# Altium schematic sheet Monostable_generator_PIC10(L)F322.SchDoc
size A4
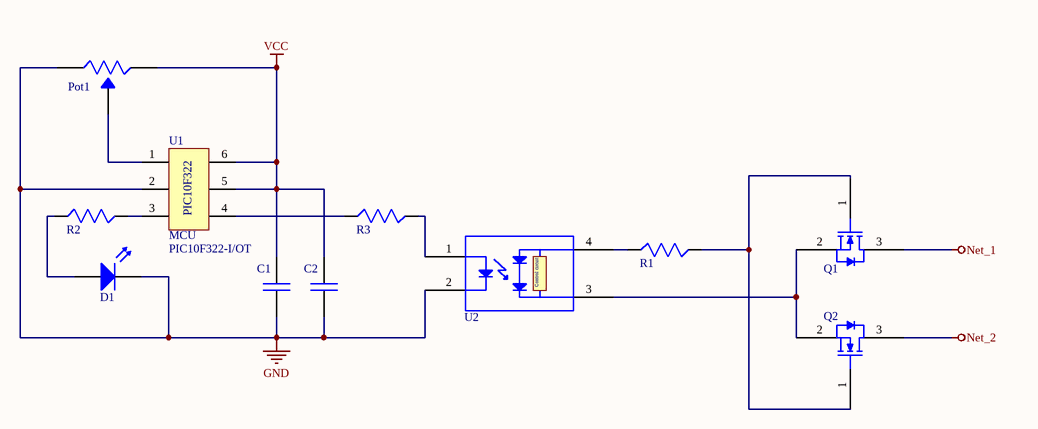
[diagram p0: Monostable_generator_PIC10(L)F322.SchDoc]

## Parts
C1  C0805C104M3RACTU  [Capacitor]  (value not drawn)
C2  C0805C104M3RACTU  [Capacitor]  (value not drawn)
D1  LED  [Diode]  (value not drawn)
Pot1  3305SMD  [CA6XVSMD]  (value not drawn)
Q1  BSS205NH6327  [SOT95P250X110-3N]  (value not drawn)
Q2  BSS205NH6327  [SOT95P250X110-3N]  (value not drawn)
R1  SWR1206-24R-5%  [Resistor]  (value not drawn)
R2  SWR1206-24R-5%  [Resistor]  (value not drawn)
R3  SWR1206-24R-5%  [Resistor]  (value not drawn)
U1  MCU  [SOT95P270X145-6N]
U2  APV2121S  [SOP254P680X210-4N]  (value not drawn)

## Nets
GND: C1.1 C2.1 D1.K Pot1.1 U1.2 U2.2
Net_1: Q1.3
Net_2: Q2.3
VCC: C1.2 C2.2 Pot1.3 U1.5 U1.6
NetD1_A: D1.A R2.1
NetPot1_2: Pot1.2 U1.1
NetQ1_1: Q1.1 Q2.1 R1.1
NetQ1_2: Q1.2 Q2.2 U2.3
NetR1_2: R1.2 U2.4
NetR2_2: R2.2 U1.3
NetR3_1: R3.1 U1.4
NetR3_2: R3.2 U2.1

## Notes on the sheet
- (in symbol APV2121S) Control circuit
- (in symbol PIC10F322-I/OT) PIC10F322

## Library data of the parts
C1 C2 = C0805C104M3RACTU: CAP CER 0.1UF 25V X7R 0805; Manufacturer: KEMET; Dielectric Material: Ceramic; Tolerance: 20%; Dissipation Factor: 5%; *: 100nF; Capacity_number: C?; Supplier 1: Digi-Key; Supplier Part Number 1: 399-8000-1-ND; RoHS: Yes; Stock 1: 353956; Pricing 1: 1=0,10000, 10=0,06500, 50=0,03520, 100=0,02870, 500=0,02052, 1000=0,01613 (USD); Mount: Surface Mount; Case/Package: 0805; Case Code (Metric): 2012; Case Code (Imperial): 0805; Min Operating Temperature: -55°C; Max Operating Temperature: 125°C; Package Quantity: 1; Voltage Rating: 25V; Packaging: Tape and Reel; Voltage Rating (DC): 25V; Dielectric: X7R; Termination: SMD/SMT; Voltage: 25V; Length: 2mm; Width: 0.049inch; Height: 0.9mm; Thickness: 0.035inch; Lead Pitch: 0.75mm; Depth: 1.25mm; Radiation Hardening: No; REACH SVHC: No SVHC; ComponentLink1URL: http://components.arrow.com/part/dataview/2091097S3491315N7429?src-supplier=Arrow+Electronics; ComponentLink1Description: http://components.arrow.com/part/dataview/2091097S3491315N7429?src-supplier=Arrow+Electronics; ComponentLink2URL: http://uk.rs-online.com/webdocs/13da/0900766b813da9ff.pdf?src-supplier=RSComponents; ComponentLink2Description: http://uk.rs-online.com/webdocs/13da/0900766b813da9ff.pdf?src-supplier=RSComponents; ComponentLink3URL: http://components.arrow.com/part/dataview/0323_00178100?src-supplier=Arrow+Europe; ComponentLink3Description: http://components.arrow.com/part/dataview/0323_00178100?src-supplier=Arrow+Europe; ComponentLink4URL: http://uk.rs-online.com/webdocs/13da/0900766b813daa05.pdf?src-supplier=RSComponents; ComponentLink4Description: http://uk.rs-online.com/webdocs/13da/0900766b813daa05.pdf?src-supplier=RSComponents; ComponentLink5URL: https://www.alliedelec.com/m/d/6f3b5eb83d09db50ed28bdc730567b33.pdf?src-supplier=Allied+Electronics; ComponentLink5Description: https://www.alliedelec.com/m/d/6f3b5eb83d09db50ed28bdc730567b33.pdf?src-supplier=Allied+Electronics; ComponentLink6URL: http://www.farnell.com/datasheets/2746330.pdf?src-supplier=Farnell; ComponentLink6Description: http://www.farnell.com/datasheets/2746330.pdf?src-supplier=Farnell; ComponentLink7URL: https://www.alliedelec.com/m/d/e7aa2b5497e2375e4ffc0e8be19e16e2.pdf?src-supplier=Allied+Electronics; ComponentLink7Description: https://www.alliedelec.com/m/d/e7aa2b5497e2375e4ffc0e8be19e16e2.pdf?src-supplier=Allied+Electronics; ComponentLink8URL: http://www.jameco.com/Jameco/Products/ProdDS/1566487.pdf?src-supplier=Jameco; ComponentLink8Description: http://www.jameco.com/Jameco/Products/ProdDS/1566487.pdf?src-supplier=Jameco; ComponentLink9URL: http://www.mouser.com/ds/2/212/KEM_C1002_X7R_SMD-1102033.pdf?src-supplier=Mouser; ComponentLink9Description: http://www.mouser.com/ds/2/212/KEM_C1002_X7R_SMD-1102033.pdf?src-supplier=Mouser; ComponentLink10URL: http://www.farnell.com/datasheets/2746330.pdf?src-supplier=Element14; ComponentLink10Description: http://www.farnell.com/datasheets/2746330.pdf?src-supplier=Element14; ComponentLink11URL: http://www.farnell.com/datasheets/1828800.pdf?src-supplier=Newark; ComponentLink11Description: http://www.farnell.com/datasheets/1828800.pdf?src-supplier=Newark; ComponentLink12URL: http://www.farnell.com/datasheets/2746330.pdf?src-supplier=Newark; ComponentLink12Description: http://www.farnell.com/datasheets/2746330.pdf?src-supplier=Newark; ComponentLink13URL: http://capacitoredge.kemet.com/capedge2/DataSheet?pn=C0805C104M3RACTU&src-supplier=Avnet; ComponentLink13Description: http://capacitoredge.kemet.com/capedge2/DataSheet?pn=C0805C104M3RACTU&src-supplier=Avnet; ComponentLink14URL: https://api.kemet.com/component-edge/download/datasheet/C0805C104M3RACTU.pdf?src-supplier=Digi-Key; ComponentLink14Description: https://api.kemet.com/component-edge/download/datasheet/C0805C104M3RACTU.pdf?src-supplier=Digi-Key; Manufacturer Part Number: C0805C104M3RACTU; Category: Ceramic Capacitors
D1 = OSO50603C1E: LED; SMD; 0603; orange; 100-200mcd; 1.6x0.8mm; 120°; 5m; Manufacturer: OptoSupply; Supplier 1: TME; Manufacturer Part Number: OSO50603C1E; Supplier Part Number 1: OSO50603C1E; RoHS: No; Stock 1: 33850; Parameter 1: LED
Q1 Q2 = BSS205NH6327: Single N-Channel 20 V 50 mOhm 2.1 nC OptiMOS? Small Signal Mosfet - SOT-23; Manufacturer: Infineon; Drain to Source Voltage (Vdss): 20V; Rds On Max: 50mR; Rise Time: 2.9ns; Continuous Drain Current (ID): 2.5A; Drain to Source Resistance: 85mR; Gate to Source Voltage (Vgs): 12V; Input Capacitance: 419pF; Max Power Dissipation: 500mW; Turn-Off Delay Time: 11ns; Turn-On Delay Time: 5.8ns; Fall Time: 2.4ns; number: Q?; Supplier 1: Digi-Key; Supplier Part Number 1: BSS205NH6327XTSA1CT-ND; Manufacturer Part Number: BSS205NH6327; RoHS: Yes; Category: MOSFETs; Stock 1: 9097; Pricing 1: 1=0,50000, 10=0,37700, 100=0,23480, 500=0,16068, 1000=0,12360 (USD); Mount: Surface Mount; Case/Package: TO-236-3; Number of Pins: 3; Min Operating Temperature: -55°C; Max Operating Temperature: 150°C; Packaging: Cut Tape; Package Quantity: 1; Element Configuration: Single; Series: OptiMOS™; Length: 2.9mm; Width: 0.1mm; Height: 1.3mm; RoHS Compliant: Yes; ComponentLink1URL: https://datasheet.ciiva.com/6379/infineon-bss205n-ds-v02-04-en-6379889.pdf?src-supplier=Digi-Key; ComponentLink1Description: https://datasheet.ciiva.com/6379/infineon-bss205n-ds-v02-04-en-6379889.pdf?src-supplier=Digi-Key; ComponentLink2URL: https://datasheet.ciiva.com/6379/infineon-bss205n-ds-v02-04-en-6379886.pdf?src-supplier=Digi-Key; ComponentLink2Description: https://datasheet.ciiva.com/6379/infineon-bss205n-ds-v02-04-en-6379886.pdf?src-supplier=Digi-Key; ComponentLink3URL: https://datasheet.ciiva.com/11171/infineon-bss205n-ds-v02-04-en-11171467.pdf?src-supplier=Avnet; ComponentLink3Description: https://datasheet.ciiva.com/11171/infineon-bss205n-ds-v02-04-en-11171467.pdf?src-supplier=Avnet
U1 = PIC10F322-I/OT: RISC Microcontroller, 8-Bit, FLASH, PIC10 CPU, 20MHz, CMOS, PDSO6; Manufacturer: Microchip; RAM Size: 64B; Number of I/Os: 3; Number of Timers/Counters: 2; Number of PWM Channels: 1; Min Supply Voltage: 2.5V; Max Supply Voltage: 5.5V; Max Power Dissipation: 800mW; Data Bus Width: 8b; Number of Programmable I/O: 4; Max Frequency: 16MHz; Watchdog Timer: Yes; Memory Size: 0.875KB; Nominal Supply Current: 800uA; Peripherals: PWM,POR,WDT; Core Architecture: PIC; Supplier 1: TME; Supplier Part Number 1: PIC10F322-I/OT; Manufacturer Part Number: PIC10F322-I/OT; RoHS: Yes; Category: Microcontrollers; Case/Package: SOT-23; Number of Pins: 6; Min Operating Temperature: -40°C; Max Operating Temperature: 85°C; Packaging: Bag; Number of ADC Channels: 3; Frequency: 20MHz; Address Bus Width: 8b; Memory Type: FLASH; Supply Current: 800uA; Length: 3.1mm; Width: 1.8mm; Height: 1.3mm; Radiation Hardening: No; REACH SVHC: No SVHC; Lead Free: Lead Free; RoHS Compliant: Yes; ComponentLink1URL: https://datasheet.ciiva.com/7665/41597a-7665378.pdf?src-supplier=Element14; ComponentLink1Description: https://datasheet.ciiva.com/7665/41597a-7665378.pdf?src-supplier=Element14; ComponentLink2URL: https://datasheet.ciiva.com/4838/41566b-59364-4838000.pdf?src-supplier=Mouser; ComponentLink2Description: https://datasheet.ciiva.com/4838/41566b-59364-4838000.pdf?src-supplier=Mouser; ComponentLink3URL: https://datasheet.ciiva.com/26937/getdatasheetpartid-765326-26937785.pdf?src-supplier=Verical; ComponentLink3Description: https://datasheet.ciiva.com/26937/getdatasheetpartid-765326-26937785.pdf?src-supplier=Verical; ComponentLink4URL: https://datasheet.ciiva.com/14100/pic10-l-lf320-322-eng-tds-14100591.pdf?src-supplier=Distrelec; ComponentLink4Description: https://datasheet.ciiva.com/14100/pic10-l-lf320-322-eng-tds-14100591.pdf?src-supplier=Distrelec; ComponentLink5URL: https://datasheet.ciiva.com/7665/1506141-7665675.pdf?src-supplier=Element14; ComponentLink5Description: https://datasheet.ciiva.com/7665/1506141-7665675.pdf?src-supplier=Element14; ComponentLink6URL: https://datasheet.ciiva.com/9233/41585a-9233513.pdf?src-supplier=Avnet; ComponentLink6Description: https://datasheet.ciiva.com/9233/41585a-9233513.pdf?src-supplier=Avnet; ComponentLink7URL: https://datasheet.ciiva.com/16352/filehandler-aspxddocname-en555020-16352362.pdf?src-supplier=Future+Electronics; ComponentLink7Description: https://datasheet.ciiva.com/16352/filehandler-aspxddocname-en555020-16352362.pdf?src-supplier=Future+Electronics; ComponentLink8URL: https://datasheet.ciiva.com/17387/41585a-17387829.pdf?src-supplier=Avnet+Europe; ComponentLink8Description: https://datasheet.ciiva.com/17387/41585a-17387829.pdf?src-supplier=Avnet+Europe; ComponentLink9URL: https://datasheet.ciiva.com/1487/41585a-1487032.pdf?src-supplier=Digi-Key; ComponentLink9Description: https://datasheet.ciiva.com/1487/41585a-1487032.pdf?src-supplier=Digi-Key
U2 = APV2121S: Photovoltaic MOSFET Driver , 4-pin SOP,; Manufacturer: Panasonic; Forward Voltage: 1.5V; Number of Channels: 1; Max Output Voltage: 8.2V; Output Current per Channel: 8uA; Reverse Breakdown Voltage: 5V; Forward Current: 50mA; Max Power Dissipation: 75mW; Isolation Voltage: 2.5kV; Input Type: DC; Supplier 1: Digi-Key; RoHS: Yes; Category: Solid State Relays; Stock 1: 1023; Pricing 1: 1=2,89000, 10=1,92600, 100=1,48220, 500=1,33984, 1000=1,18500 (USD); Mount: Surface Mount; Case/Package: SOP; Number of Pins: 4; Min Operating Temperature: -40°C; Max Operating Temperature: 85°C; Packaging: Rail/Tube; Package Quantity: 100; Number of Elements: 1; Power Dissipation: 75mW; Reverse Voltage (DC): 5V; Series: -; RMS Current (Irms): 8uA; Output Current: 8uA; Output Voltage: 5V; Voltage Rating (DC): 2.5kV; Termination: SMD/SMT; Input Current: 50mA; RoHS Compliant: Yes; Lead Free: Lead Free; REACH SVHC: No SVHC; ComponentLink1URL: https://datasheet.ciiva.com/24491/semi-eng-apv-24491093.pdf?src-supplier=Onlinecomponents.com; ComponentLink1Description: https://datasheet.ciiva.com/24491/semi-eng-apv-24491093.pdf?src-supplier=Onlinecomponents.com; ComponentLink2URL: https://datasheet.ciiva.com/1526/625948-1526211.pdf?src-supplier=Element14; ComponentLink2Description: https://datasheet.ciiva.com/1526/625948-1526211.pdf?src-supplier=Element14; Supplier Part Number 1: 255-2658-ND; Manufacturer Part Number: APV2121S